# Altium project PCB_Siren.PrjPcb
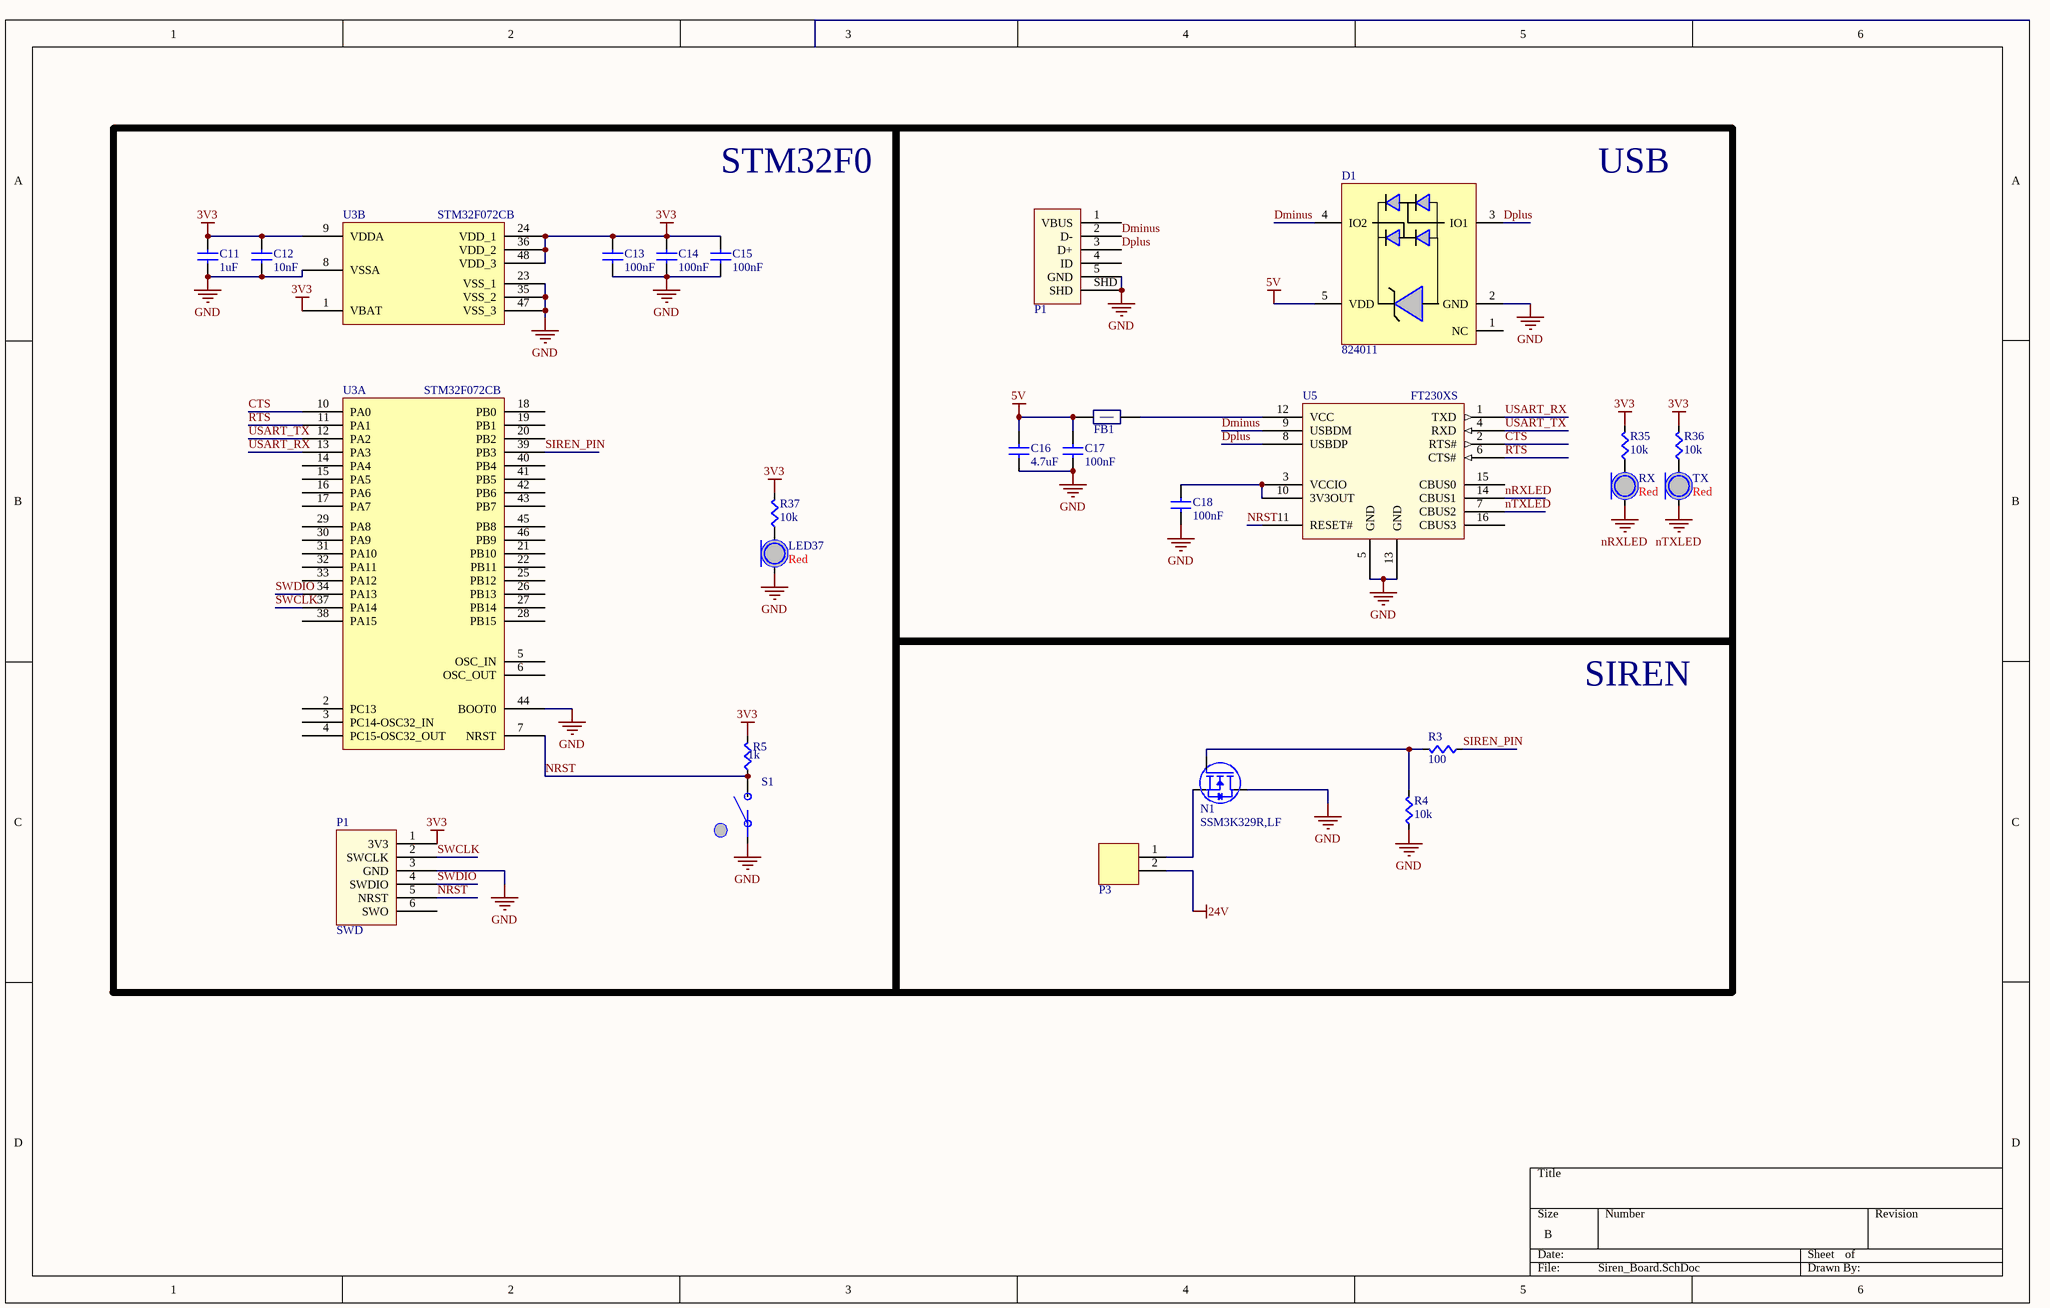
[diagram p0: Siren_Board.SchDoc]
3 sheets, 42 parts. Net scope: global (net labels, ports and power ports of the same name join across sheets).
Board file: Siren.PcbDoc
Sheets:
  Siren_Board.SchDoc
  24Vto5Vat1A-R1.SchDoc
  5Vto3V3_Power_Connector.SchDoc

## Sheet Siren_Board.SchDoc
size B

### Parts
(Parts that share a designator on the sheet are numbered #1, #2 ... from top to bottom, then left to right.)
C11  value 1uF  [CAPC0603]  (hidden comment: Cap)
C12  value 10nF  [CAPC0603]  (hidden comment: Cap)
C13  value 100nF  [CAPC0603]  (hidden comment: Cap)
C14  value 100nF  [CAPC0603]  (hidden comment: Cap)
C15  value 100nF  [CAPC0603]  (hidden comment: Cap)
C16  value 4.7uF  [CAPC0603]  (hidden comment: Cap)
C17  value 100nF  [CAPC0603]  (hidden comment: Cap)
C18  value 100nF  [CAPC0603]  (hidden comment: Cap)
D1  824011  [SOT95P280X116-5N]
FB1  FBead  [RES0603]  (value not drawn)
LED37  Color: Red  [LED0603]  (hidden comment: LED)
N1  SSM3K329R,LF  [SSM3K329R,LF]
P1#1  UX60SC-MB-5ST  [UX60SC-MB-5ST]  (value not drawn)
P1#2  SWD  [SWD_STM32]
P3  2-pin Horz Sherlock  [MOLEX-HDR-1X2-SHERLOCK-HORZ]  (value not drawn)
R3  value 100  [RES0603]  (hidden comment: Res)
R4  value 10k  [RES0603]  (hidden comment: Res)
R5  value 1k  [RES0603]  (hidden comment: Res)
R35  value 10k  [RES0603]  (hidden comment: Res)
R36  value 10k  [RES0603]  (hidden comment: Res)
R37  value 10k  [RES0603]  (hidden comment: Res)
RX  Color: Red  [LED0603]  (hidden comment: LED)
S1  Button  [PTS645xxxxSMTR92]  (value not drawn)
TX  Color: Red  [LED0603]  (hidden comment: LED)
U3  STM32F072CB  [STM32F072CB]  (parts A,B of 2)
U5  FT230XS  [FT230XS]

### Blocks framed on the sheet
STM32F0: C11-C15 LED37 P1#2 R5 R37 S1 U3
USB: C16-C18 D1 FB1 P1#1 R35 R36 RX TX U5
SIREN: N1 P3 R3 R4

### Nets
3V3: C11.1(A) C12.1(A) C13.1(A) C14.1(A) C15.1(A) P1#2.1(3V3) R5.1(A) R35.1(A) R36.1(A) R37.1(A) U3.1(VBAT) U3.9(VDDA) U3.24(VDD_1) U3.36(VDD_2) U3.48(VDD_3)
5V: C16.1(A) C17.1(A) D1.5(VDD) FB1.1(A)
24V: P3.2
GND: C11.2(B) C12.2(B) C13.2(B) C14.2(B) C15.2(B) C16.2(B) C17.2(B) C18.2(B) D1.2(GND) LED37.C N1.3(D) P1#1.5(GND) P1#1.SHD P1#2.3(GND) R4.2(B) S1.A U3.8(VSSA) U3.23(VSS_1) U3.35(VSS_2) U3.44(BOOT0) U3.47(VSS_3) U5.5(GND) U5.13(GND)
nRXLED: RX.C U5.14(CBUS1)
nTXLED: TX.C U5.7(CBUS2)
CTS: U3.10(PA0) U5.2(RTS#)
Dminus: D1.4(IO2) P1#1.2(D-) U5.9(USBDM)
Dplus: D1.3(IO1) P1#1.3(D+) U5.8(USBDP)
NRST: P1#2.5(NRST) R5.2(B) S1.B U3.7(NRST) U5.11(RESET#)
RTS: U3.11(PA1) U5.6(CTS#)
SIREN_PIN: R3.1(A) U3.39(PB3)
SWCLK: P1#2.2(SWCLK) U3.37(PA14)
SWDIO: P1#2.4(SWDIO) U3.34(PA13)
USART_RX: U3.13(PA3) U5.1(TXD)
USART_TX: U3.12(PA2) U5.4(RXD)
NetC18_1: C18.1(A) U5.3(VCCIO) U5.10(3V3OUT)
NetFB1_2: FB1.2(B) U5.12(VCC)
NetLED37_A: LED37.A R37.2(B)
NetN1_1: N1.1(G) R3.2(B) R4.1(A)
NetN1_2: N1.2(S) P3.1
NetR35_2: R35.2(B) RX.A
NetR36_2: R36.2(B) TX.A

Not connected (* = marked no-connect by the designer): D1 1(NC); P1#1 1(VBUS) 4(ID); P1#2 6(SWO); U3 2(PC13) 3(PC14-OSC32_IN) 4(PC15-OSC32_OUT) 5(OSC_IN) 6(OSC_OUT) 14(PA4) 15(PA5) 16(PA6) 17(PA7) 18(PB0) 19(PB1) 20(PB2) 21(PB10) 22(PB11) 25(PB12) 26(PB13) 27(PB14) 28(PB15) 29(PA8) 30(PA9) 31(PA10) 32(PA11) 33(PA12) 38(PA15) 40(PB4) 41(PB5) 42(PB6) 43(PB7) 45(PB8) 46(PB9); U5 15(CBUS0) 16(CBUS3)

### Library data of the parts
D1 = 824011: USB ESD Protection Diodes
FB1 = FBead: Ferrite Bead; Supplier 1: Digi-Key; Supplier Part Number 1: 445-2988-1-ND
N1 = SSM3K329R,LF: MOSFET N CH 30V 3.5A 2-3Z1A; Manufacturer 1: Toshiba Semiconductor and Storage; Supplier 1: Digi-Key; Supplier Part Number 1: SSM3K329RLFTR-ND; Manufacturer Part Number 1: SSM3K329R,LF
P1#1 = UX60SC-MB-5ST: USB Mini B Metal Shield SMT; Supplier 1: Digi-Key; Supplier Part Number 1: H11671CT-ND
P1#2 = SWD_STM32: SWD connector matching the pinout on STM Discovery Boards
P3 = MOLEX-HDR-1x2-SHERLOCK_RA: Header, Molex, 2mm Pitch Sherlock Header, Single Row, Horizontal, 2 Circuits, Length 3.3mm,  0353630260; Manufacturer: Molex Inc; Manufacturer Part Number: 0353630260; Supplier Part Number 1: WM18931-ND; Supplier 1: Digi-Key
S1 = Button: SPST Button; Supplier 1: Digi-Key; Supplier Part Number 1: CKN9087CT-ND
U3 = STM32F072CB: MCU 32BIT 128KB FLASH 48LQFP; Supplier 1: Digi-Key; Supplier Part Number 1: 497-14645-ND
U5 = FT230XS: USB To Basic UART IC; Supplier 1: Digi-Key; Supplier Part Number 1: 768-1154-5-ND
C11-C18 = Cap: Supplier 1: Digi-Key
  C13-C15 C17 C18: Supplier Part Number 1: 1276-1000-1-ND
  C16: Supplier Part Number 1: 311-1455-1-ND
LED37 RX TX = LED: Supplier 1: Digi-Key; Supplier Part Number 1: 754-1122-1-ND
R3-R5 R35-R37 = Res: Supplier 1: Digi-Key
  R3: Supplier Part Number 1: 311-100LRDKR-ND
  R4 R35-R37: Supplier Part Number 1: RMCF0603JT10K0CT-ND

## Sheet 24Vto5Vat1A-R1.SchDoc
size A
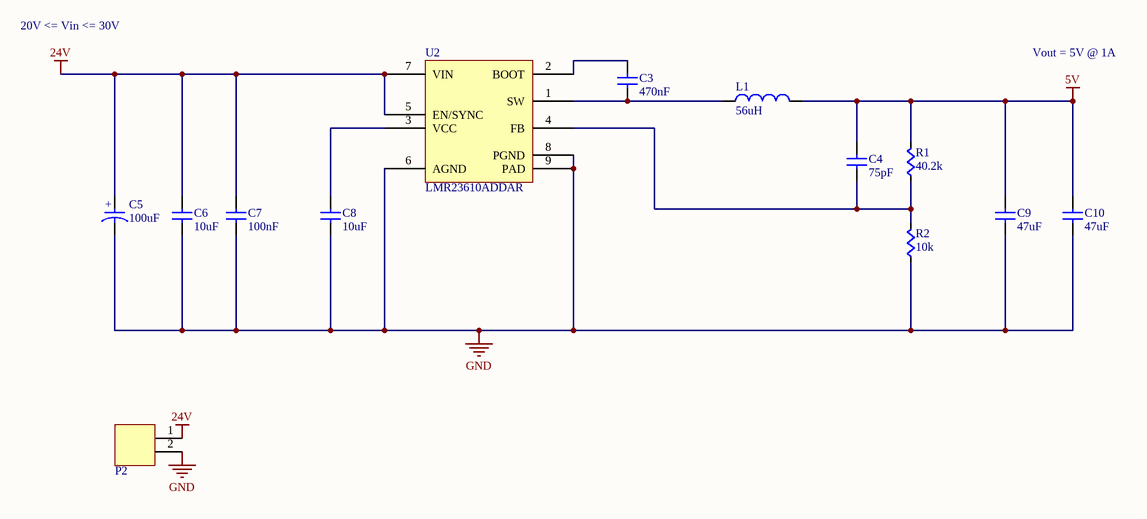
[diagram p1: 24Vto5Vat1A-R1.SchDoc]

### Parts
C3  value 470nF  [CAPC0603]  (hidden comment: Cap)
C4  value 75pF  [CAPC0603]  (hidden comment: Cap)
C5  value 100uF  [EEHZA1H101P]  (hidden comment: EEHZA1H101P)
C6  value 10uF  [CAP1210]  (hidden comment: Cap)
C7  value 100nF  [CAPC0603]  (hidden comment: Cap)
C8  value 10uF  [CAPC0603]  (hidden comment: Cap)
C9  value 47uF  [CAP1210]  (hidden comment: Cap)
C10  value 47uF  [CAP1210]  (hidden comment: Cap)
L1  value 56uH  [MSS1048-563MLB]  (hidden comment: MSS1048-563MLB)
P2  2-pin Horz Sherlock  [MOLEX-HDR-1X2-SHERLOCK-HORZ]  (value not drawn)
R1  value 40.2k  [RES0603]  (hidden comment: Res)
R2  value 10k  [RES0603]  (hidden comment: Res)
U2  LMR23610ADDAR  [LMR23610ADDAR]

### Nets
5V: C4.1(A) C9.1(A) C10.1(A) L1.2 R1.1(A)
24V: C5.1 C6.1(A) C7.1(A) P2.1 U2.5(EN/SYNC) U2.7(VIN)
GND: C5.2 C6.2(B) C7.2(B) C8.2(B) C9.2(B) C10.2(B) P2.2 R2.2(B) U2.6(AGND) U2.8(PGND) U2.9(PAD)
NetC3_1: C3.1(A) U2.2(BOOT)
NetC3_2: C3.2(B) L1.1 U2.1(SW)
NetC4_2: C4.2(B) R1.2(B) R2.1(A) U2.4(FB)
NetC8_1: C8.1(A) U2.3(VCC)

### Notes on the sheet
- 20V <= Vin <= 30V
- Vout = 5V @ 1A
- (in symbol EEHZA1H101P) +

### Library data of the parts
C5 = EEHZA1H101P: CAP ALUM POLY HYB 100UF 50V SMD; Manufacturer 1: Panasonic; Tolerance: 20%; Supplier 1: Digi-Key; Supplier Part Number 1: P15442CT-ND; Manufacturer Part Number 1: EEHZA1H101P; Voltage: 50V; ComponentLink1URL: https://na.industrial.panasonic.com/products/capacitors/aluminum-electrolytic-capacitors/conductive-polymer-hybrid-aluminum-electrolytic/series/za-high-temp-reflow/ABA0135/model/EEHZA1H101P; ComponentLink1Description: Web Site; ComponentLink2URL: https://industrial.panasonic.com/cdbs/www-data/pdf/RDD0000/ABA0000C1221.pdf; ComponentLink2Description: Data Sheet; ComponentLink3URL: https://industrial.panasonic.com/cdbs/www-data/pdf/RDD0000/ABA0000COS44.pdf; ComponentLink3Description: ZA Series Technical Data
L1 = MSS1048-563MLB: FIXED IND 56UH 1.7A 126 MOHM; Manufacturer 1: Coilcraft; Manufacturer Part Number 1: MSS1048-563MLB; ComponentLink1Description: Web Site; ComponentLink1URL: https://www.coilcraft.com/mss1048.cfm; Supplier 1: Coilcraft; Supplier Part Number 1: MSS1048-563MLB
P2 = MOLEX-HDR-1x2-SHERLOCK_RA: as P3 on sheet Siren_Board; Manufacturer Part Number: 0353630260; Supplier Part Number 1: WM18931-ND; Supplier 1: Digi-Key
U2 = LMR23610ADDAR: IC REG BUCK ADJ 1A SYNC 8SOPWRPD; Manufacturer 1: Texas Instruments; Supplier 1: Digi-Key; Supplier Part Number 1: 296-47267-1-ND; Manufacturer Part Number 1: LMR23610ADDAR; ComponentLink1URL: http://www.ti.com/lit/ds/symlink/lmr23610.pdf; ComponentLink1Description: Datasheet; ComponentLink2URL: http://www.ti.com/product/LMR23610/description; ComponentLink2Description: Web Site
C3 C4 C6-C10 = Cap: Supplier 1: Digi-Key
  C3 C4 C6-C8: Supplier Part Number 1: 1276-1000-1-ND
  C9 C10: Supplier Part Number 1: 490-6538-1-ND
R1 R2 = Res: Supplier 1: Digi-Key
  R1: Supplier Part Number 1: RMCF0603FT40K2CT-ND
  R2: Supplier Part Number 1: RMCF0603JT10K0CT-ND

## Sheet 5Vto3V3_Power_Connector.SchDoc
size A
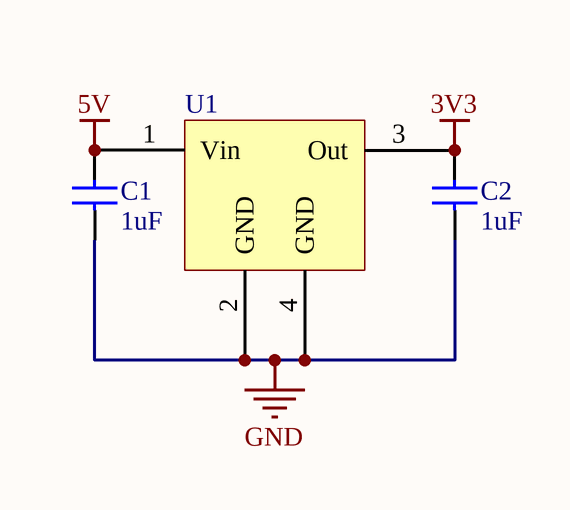
[diagram p2: 5Vto3V3_Power_Connector.SchDoc]

### Parts
C1  value 1uF  [CAPC0603]  (hidden comment: Cap)
C2  value 1uF  [CAPC0603]  (hidden comment: Cap)
U1  3.3V LDO Reg  [SOT23-4n]  (value not drawn)

### Nets
3V3: C2.1(A) U1.3(Out)
5V: C1.1(A) U1.1(Vin)
GND: C1.2(B) C2.2(B) U1.2(GND) U1.4(GND)

### Library data of the parts
U1 = LM3940IMPX-3.3: IC REG LDO 3.3V 1A SOT223; Supplier 1: Digi-Key; Supplier Part Number 1: LM3940IMPX-3.3/NOPBCT-ND
C1 C2 = Cap: Supplier 1: Digi-Key; Supplier Part Number 1: 1276-1000-1-ND

## Nets that join several sheets
3V3: Siren_Board (15 pins), 5Vto3V3_Power_Connector (C2.1 U1.3)
5V: Siren_Board (C16.1 C17.1 D1.5 FB1.1), 24Vto5Vat1A-R1 (5 pins), 5Vto3V3_Power_Connector (C1.1 U1.1)
24V: Siren_Board (P3.2), 24Vto5Vat1A-R1 (6 pins)
GND: Siren_Board (23 pins), 24Vto5Vat1A-R1 (11 pins), 5Vto3V3_Power_Connector (C1.2 C2.2 U1.2 U1.4)